# Altium schematic sheet Thermal_MGT.SchDoc: Temperature
size 420 x 297 mm; Author: G.Kasprowicz; CompanyName: WUT ISE; DrawnBy: G.Kasprowicz; Organization: WUT ISE; Address1: PW ISE; Address2: Nowowiejska 15/19 00-665 Warsaw; Address3: gkasprow@gmail.com; DocumentNumber: 12; Revision: 2; SheetNumber: 12; SheetTotal: 18; ModifiedBy: -; CheckedDate: -; Title2: management; DivGrp: WUT ISE; Designer: G.Kasprowicz; ModifiedDate: -; ProjectName: Sensor Box
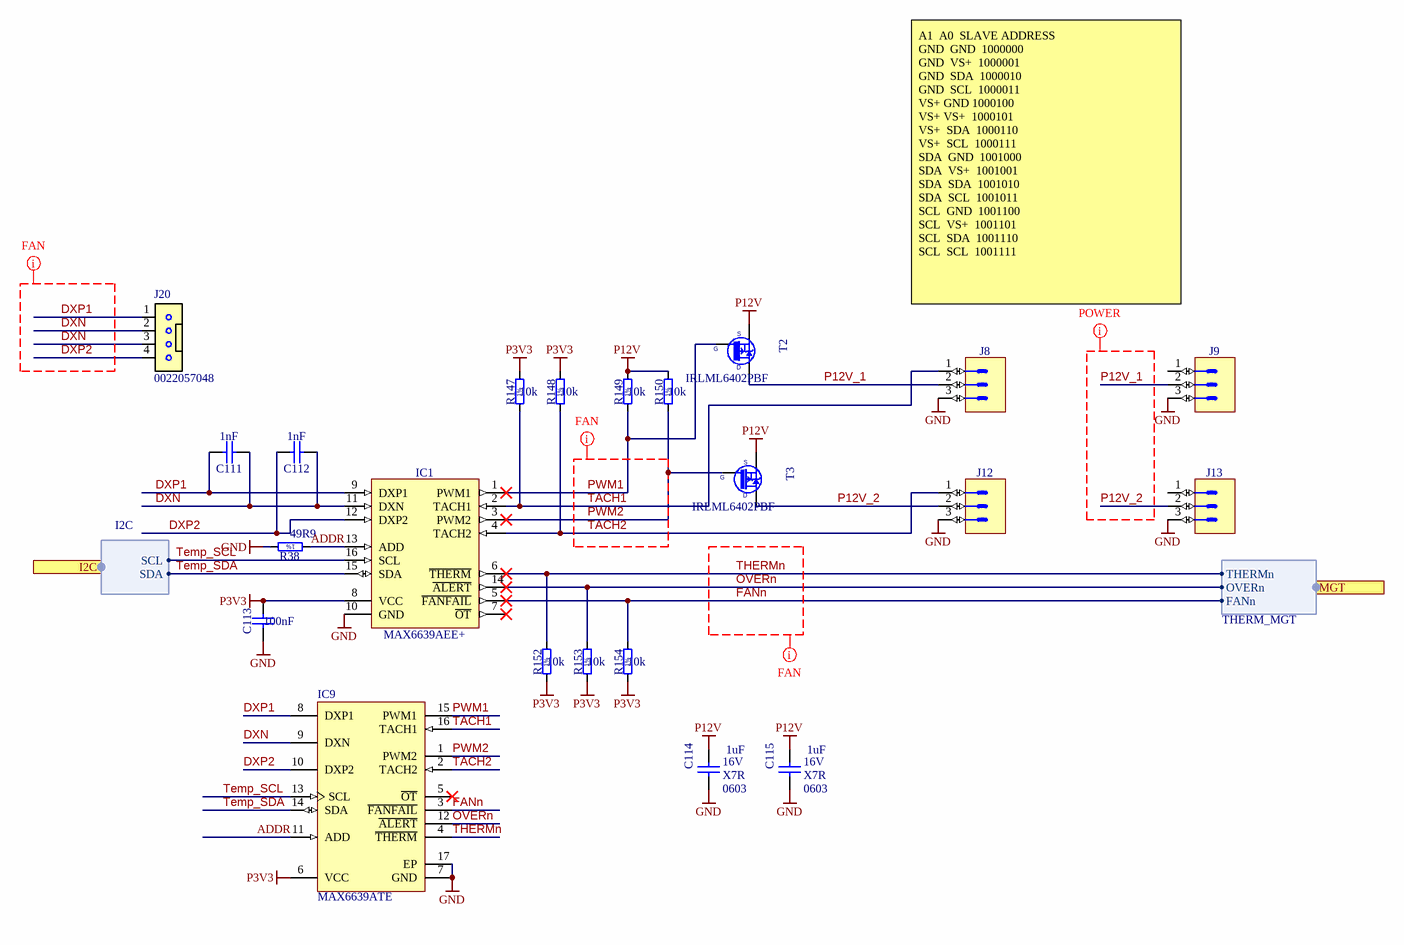
[diagram p0: Thermal_MGT.SchDoc]

## Parts
C111  1nF  [CAPC1005X55N]
C112  1nF  [CAPC1005X55N]
C113  100nF  [CAPC1005X55N]
C114  1uF  Voltage: 16V  TC: X7R  Case: 0603  [CAPC1608X87N]
C115  1uF  Voltage: 16V  TC: X7R  Case: 0603  [CAPC1608X87N]
IC1  MAX6639AEE+  [SOP63P600X175-16N]
IC9  MAX6639ATE  [MAXM-T1655-3_N]
J8  KK®  [MOLEX_22-05-7038]  (value not drawn)
J9  KK®  [MOLEX_22-05-7038]  (value not drawn)
J12  KK®  [MOLEX_22-05-7038]  (value not drawn)
J13  KK®  [MOLEX_22-05-7038]  (value not drawn)
J20  0022057048  [CON_0022057048]
R38  49R9  [RESC1005X40N]
R147  10k  [RESC1005X40N]
R148  10k  [RESC1005X40N]
R149  10k  [RESC1005X40N]
R150  10k  [RESC1005X40N]
R152  10k  [RESC1005X40N]
R153  10k  [RESC1005X40N]
R154  10k  [RESC1005X40N]
T2  IRLML6402PBF  [SOT95P237X112-3N]
T3  IRLML6402PBF  [SOT95P237X112-3N]

## Ports
I2C (harness I2C), MGT (harness THERM_MGT)

## Harnesses
I2C: SCL, SDA
THERM_MGT: OVERn, THERMn, FANn

## Nets
GND: C113.1 C114.1 C115.1 IC1.10(GND) IC9.7(GND) IC9.17(EP) J8.3 J9.3 J12.3 J13.3 R38.2
P3V3: C113.2 IC1.8(VCC) IC9.6(VCC) R147.2 R148.2 R152.1 R153.1 R154.1
P12V: C114.2 C115.2 R149.2 R150.2 T2.2(S) T3.2(S)
ADDR: IC1.13(ADD) IC9.11(ADD) R38.1
DXN: C111.1 C112.1 IC1.11(DXN) IC9.9(DXN) J20.2 J20.3
DXP1: C111.2 IC1.9(DXP1) IC9.8(DXP1) J20.1
DXP2: C112.2 IC1.12(DXP2) IC9.10(DXP2) J20.4
FANn: IC1.5(~{FANFAIL}) IC9.3(~{FANFAIL}) R154.2 ; port MGT.FANn
OVERn: IC1.14(~{ALERT}) IC9.12(~{ALERT}) R153.2 ; port MGT.OVERn
P12V_1: J8.2 J9.2 T2.3(D)
P12V_2: J12.2 J13.2 T3.3(D)
PWM1: IC1.1(PWM1) IC9.15(PWM1) R149.1 T2.1(G)
PWM2: IC1.3(PWM2) IC9.1(PWM2) R150.1 T3.1(G)
TACH1: IC1.2(TACH1) IC9.16(TACH1) J8.1 R147.1
TACH2: IC1.4(TACH2) IC9.2(TACH2) J12.1 R148.1
Temp_SCL: IC1.16(SCL) IC9.13(SCL) ; port I2C.SCL
Temp_SDA: IC1.15(SDA) IC9.14(SDA) ; port I2C.SDA
THERMn: IC1.6(~{THERM}) IC9.4(~{THERM}) R152.2 ; port MGT.THERMn

Not connected (* = marked no-connect by the designer): IC1 7(~{OT})*; IC9 5(~{OT})*; J9 1; J13 1

## Layout directives
net class POWER: P12V_1, P12V_2
net class FAN: DXN, DXP1, DXP2, FANn, OVERn, PWM1, PWM2, TACH1, TACH2, THERMn

## Notes on the sheet
- A1 	A0 	SLAVE ADDRESS
  GND 	GND 	1000000
  GND 	VS+ 	1000001
  GND 	SDA 	1000010
  GND 	SCL 	1000011
  VS+	GND	1000100
  VS+	VS+ 	1000101
  VS+ 	SDA 	1000110
  VS+ 	SCL 	1000111
  SDA 	GND 	1001000
  SDA 	VS+ 	1001001
  SDA 	SDA 	1001010
  SDA 	SCL 	1001011
  SCL 	GND 	1001100
  SCL 	VS+ 	1001101
  SCL 	SDA 	1001110
  SCL 	SCL 	1001111
- Project/Equipment
- Document
- Designer
- Drawn by
- Check.by
- Copyright WUT ISE 2020.
  This documentation describes Open Hardware and is licensed under the CERN OHL v.1.2. You may redistribute and modify this documentation under the terms of the CERN OHL v.1.2. (http://ohwr.org/CERNOHL). This documentation is distributed WITHOUT ANY EXPRESS OR IMPLIED WARRANTY, INCLUDING OF MERCHANTABILITY, SATISFACTORY QUALITY AND FITNESS FOR A PARTICULAR PURPOSE. Please see the CERN OHL v.1.2 for applicable conditions.
- Contact
- File
- Last Mod.
- Print Date
- Sheet
- Size
- A3
- of
- Rev
- (in symbol R0402_10K_1%_0.0625W_100PPM) 1%
- (in symbol R0402_49R9_1%_0.0625W_100PPM) 1%

## Library data of the parts
C111 C112 = CC0402_1NF_50V_10%_X7R: Non-polarised capacitor; Part Description: SMD Multilayer Chip Ceramic Capacitor; Manufacturer: GENERIC; Manufacturer1 Part Number: 223858715623; Voltage: 50V; TC: X7R; Tolerance: ±10%; Part Number: CC0402_1NF_50V_10%_X7R; Component Kind: Standard; Component Type: Standard; Pin Count: 2; Value: 1nF; Status: Not Recommended; Manufacturer Part Number: CC0402_1NF_50V_10%_X7R; Case: 0402; Mounted: Yes; Socket: No; SMD: Yes; Manufacturer1 Example: PHYCOMP; Manufacturer1 ComponentHeight: 0.55mm; HelpURL: \\cern.ch\dfs\Applications\Altium\Datasheets\CC0402_X7R_PHYCOMP.pdf; Author: CERN DEM JLC; CreateDate: 03.12.2007; LatestRevisionDate: 03.12.2007; Sense: No
C113 = CC0402_100NF_16V_10%_X5R: Non-polarised capacitor; Part Description: SMD Multilayer Chip Ceramic Capacitor; Manufacturer: GENERIC; Manufacturer1 Part Number: GRM155R61C104KA88D; Voltage: 16V; TC: X5R; Tolerance: ±10%; Part Number: CC0402_100NF_16V_10%_X5R; Component Kind: Standard; Component Type: Standard; Pin Count: 2; Value: 100nF; Status: None; Manufacturer Part Number: CC0402_100NF_16V_10%_X5R; Case: 0402; Mounted: Yes; Socket: No; SMD: Yes; Manufacturer1 Example: MURATA; Manufacturer1 ComponentHeight: 0.55mm; HelpURL: \\cern.ch\dfs\Applications\Altium\Datasheets\CC0402_X5R_MURATA_GRM.pdf; Author: CERN DEM JLC; CreateDate: 10.12.2013; LatestRevisionDate: 10.12.2013; Sense: No
C114 C115 = CC0603_1UF_16V_10%_X7R: Non-polarised capacitor; Part Description: SMD Multilayer Chip Ceramic Capacitor; Manufacturer: GENERIC; Manufacturer1 Part Number: 223824613663; Tolerance: ±10%; Table: Capacitors SMD; Part Number: CC0603_1UF_16V_10%_X7R; Component Kind: Standard; Component Type: Standard; Pin Count: 2; Value: 1uF; Status: Preferred; Manufacturer Part Number: CC0603_1uF_16V_10%_X7R; Mounted: Yes; Socket: No; SMD: Yes; Manufacturer1 Example: PHYCOMP; Manufacturer1 ComponentHeight: 0.87mm; HelpURL: \\cern.ch\dfs\Applications\Altium\Datasheets\CC0805_X5R_PHYCOMP_HC.pdf; Author: CERN DEM JLC; CreateDate: 12/3/2007; LatestRevisionDate: 12/3/2007
IC1 = MAX6639AEE+: 2-Channel Temperature Monitor with Dual, Automatic, PWM Fan-Speed Controller; Manufacturer: MAXIM; Table: Analog & Interface; Part Number: MAX6639AEE+; Component Kind: Standard; Component Type: Standard; Device: MAX6639AEE+; PackageDescription: SOP, 0.635mm pitch; 16 pin, 3.9mm W X 4.895mm L X 1.75mm H Body, IPC Medium Density; Part Description: 2-Channel Temperature Monitor with Dual, Automatic, PWM Fan-Speed Controller; Manufacturer Part Number: MAX6639AEE+; Pin Count: 16; Case: SSOP16; Mounted: Yes; Socket: No; SMD: Yes; ComponentHeight: 1.75mm; Author: CERN DEM JLC; HelpURL: \\cern.ch\dfs\Applications\Altium\Datasheets\MAX6639AEE+.pdf; CreateDate: 2012-08-15; LatestRevisionDate: 2012-08-15
IC9 = CMP-0253-00500-2: 2-Channel Temperature Monitor with Dual, Automatic, PWM Fan-Speed Controller, -40 to 125 degC, 16-Pin QFN (T1655-3); Fan Controller Functions: Remote & Local Sensor; Interface: 2-Wire/I2C/SMBus; ComponentLink1URL: http://www.maximintegrated.com/; DatasheetVersion: Rev. 2; ComponentLink2Description: Datasheet; ComponentLink2URL: http://datasheets.maximintegrated.com/en/ds/MAX6639-MAX6639F.pdf; Code_JEDEC: MO220; Fan Cntrl.: PWM; PackageReference: T1655-3; PartNumber: MAX6639ATE; ComponentLink3URL: http://pdfserv.maximintegrated.com/package_dwgs/21-0140.PDF; Mounting Technology: Surface Mount; PackageDescription: 16-Pin Thin Quad Flatpack, No Leads, Body 5 x 5 mm, Pitch 0.8 mm; ComponentLink3Description: Package Specification; Generic Part Number: MAX6639; PackageVersion: Rev. Q, 09/2011; ComponentLink1Description: Manufacturer URL
J8 J9 J12 J13 = MOLEX_22-05-7038: Connector 3 Male; Part Description: 2.54mm (.100") Pitch KK® Wire-To-Board Header, Right Angle, With Friction Lock, 3 Circuits; Manufacturer: MOLEX; PressFit: No; Part Number: MOLEX_22-05-7038; Component Kind: Standard; Component Type: Standard; Pin Count: 3; Family: KK®; Mounted: Yes; Socket: No; SMD: No; Sense: No; Status: None; Manufacturer Part Number: 22-05-7038; ComponentHeight: 5.8mm; HelpURL: \\cern.ch\dfs\Applications\Altium\Datasheets\MOLEX_22-05-7038.pdf; Author: CERN DEM JLC; CreateDate: 19.09.2012; LatestRevisionDate: 19.09.2012
J20 = CON_4_2.54_RA_key: 2.54mm crimped terminal header
R38 = R0402_49R9_1%_0.0625W_100PPM: Resistor - 1%; Part Description: General Purpose Thick Film Chip Resistor; Manufacturer: GENERIC; Manufacturer1 Part Number: 232270674999L or RC0402FR-0749R9L; TC: ±100ppm/°C; Table: Resistors SMD; Part Number: R0402_49R9_1%_0.0625W_100PPM; Component Kind: Standard; Component Type: Standard; Pin Count: 2; Value: 49R9; Status: Not recommended; Power: 0.0625W; Tolerance: ±1%; Manufacturer Part Number: R0402_49R9_1%_0.0625W_100PPM; Case: 0402; Mounted: Yes; Socket: No; SMD: Yes; Manufacturer1 Example: YAGEO PHYCOMP; Manufacturer1 ComponentHeight: 0.4mm; HelpURL: \\cern.ch\dfs\Applications\Altium\Datasheets\R0402_Phycomp_RC0402.pdf; Author: CERN DEM JLC; CreateDate: 2012-10-24; LatestRevisionDate: 2012-10-24
R147-R150 R152-R154 = R0402_10K_1%_0.0625W_100PPM: Resistor - 1%; Part Description: General Purpose Thick Film Chip Resistor; Manufacturer: GENERIC; Manufacturer1 Part Number: 232270671003L; TC: ±100ppm/°C; Table: Resistors SMD; Part Number: R0402_10K_1%_0.0625W_100PPM; Component Kind: Standard; Component Type: Standard; Pin Count: 2; Value: 10k; Status: Not recommended; Power: 0.0625W; Tolerance: ±1%; Manufacturer Part Number: R0402_10K_1%_0.0625W_100PPM; Case: 0402; Mounted: Yes; Socket: No; SMD: Yes; Manufacturer1 Example: YAGEO PHYCOMP; Manufacturer1 ComponentHeight: 0.4mm; HelpURL: \\cern.ch\dfs\Applications\Altium\Datasheets\R0402_Phycomp_RC0402.pdf; Author: CERN DEM JLC; CreateDate: 2007-12-03; LatestRevisionDate: 2012-10-17
T2 T3 = IRLML6402PBF: P-CHANNEL MOSFET WITH ZENER DIODE; Part Description: -20V -3.7A P-Channel HEXFET® Power MOSFET; Manufacturer: INTERNATIONAL RECTIFIER; PressFit: No; Bonding: No; Part Number: IRLML6402PBF; Component Kind: Standard; Component Type: Standard; Device: IRLML6402PBF; PackageDescription: SOT, 0.95mm, pitch; 3 pin,1.30mm W X 2.92mm L X 1.12mm H body, IPC Medium Density; Manufacturer Part Number: IRLML6402PBF; Pin Count: 3; Case: SOT23-3; Mounted: Yes; Socket: No; SMD: Yes; Sense: No; ComponentHeight: 1.12mm; HelpURL: \\cern.ch\dfs\Applications\Altium\Datasheets\IRLML6402PBF.pdf; Author: CERN DEM JLC; CreateDate: 8/29/2011; LatestRevisionDate: 8/29/2011